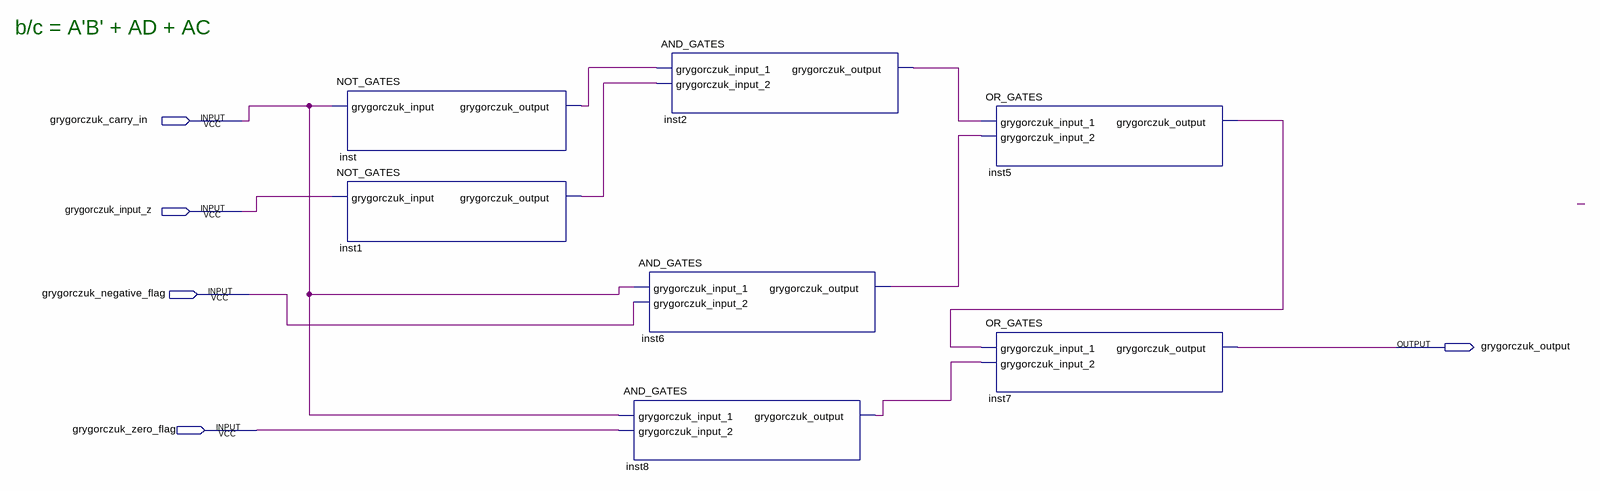
[diagram p0: schematic sheet]
// Quartus schematic SEVEN_SEGMENT_DISPLAY_PLUS_MINUS_ONE_C_B.bdf as structural Verilog: 7 symbols, 5 pins
module SEVEN_SEGMENT_DISPLAY_PLUS_MINUS_ONE_C_B (
  input  grygorczuk_carry_in,
  input  grygorczuk_input_z,
  input  grygorczuk_negative_flag,
  input  grygorczuk_zero_flag,
  output grygorczuk_output
);

  wire inst1_grygorczuk_output, inst2_grygorczuk_output, inst5_grygorczuk_output, inst6_grygorczuk_output,
       inst8_grygorczuk_output, inst_grygorczuk_output;

  NOT_GATES inst (.grygorczuk_input(grygorczuk_carry_in), .grygorczuk_output(inst_grygorczuk_output));
  NOT_GATES inst1 (.grygorczuk_input(grygorczuk_input_z), .grygorczuk_output(inst1_grygorczuk_output));
  AND_GATES inst8 (
    .grygorczuk_input_1(grygorczuk_carry_in), .grygorczuk_input_2(grygorczuk_zero_flag),
    .grygorczuk_output(inst8_grygorczuk_output));
  AND_GATES inst2 (
    .grygorczuk_input_1(inst_grygorczuk_output), .grygorczuk_input_2(inst1_grygorczuk_output),
    .grygorczuk_output(inst2_grygorczuk_output));
  AND_GATES inst6 (
    .grygorczuk_input_1(grygorczuk_carry_in), .grygorczuk_input_2(grygorczuk_negative_flag),
    .grygorczuk_output(inst6_grygorczuk_output));
  OR_GATES inst5 (
    .grygorczuk_input_1(inst2_grygorczuk_output), .grygorczuk_input_2(inst6_grygorczuk_output),
    .grygorczuk_output(inst5_grygorczuk_output));
  OR_GATES inst7 (
    .grygorczuk_input_1(inst5_grygorczuk_output), .grygorczuk_input_2(inst8_grygorczuk_output),
    .grygorczuk_output(grygorczuk_output));

  // Notes on the sheet:
  //   b/c = A'B' + AD + AC
endmodule
